# Altium schematic sheet COMPASS 3 AXIS.SchDoc
size A4
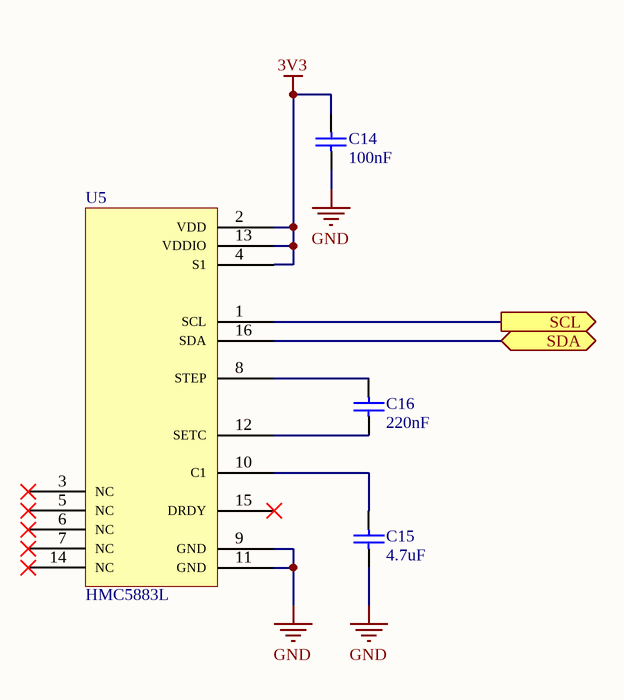
[diagram p0: COMPASS 3 AXIS.SchDoc]

## Parts
C14  100nF  [C0603(1608)]
C15  4.7uF  [C0603(1608)]
C16  220nF  [C0603(1608)]
U5  HMC5883L  [LGA 16 - 3x3]

## Ports
SCL (out), SDA (bidir)

## Nets
3V3: C14.2 U5.2(VDD) U5.4(S1) U5.13(VDDIO)
GND: C14.1 C15.1 U5.9(GND) U5.11(GND)
SCL: U5.1(SCL) ; port SCL
SDA: U5.16(SDA) ; port SDA
NetC15_2: C15.2 U5.10(C1)
NetC16_1: C16.1 U5.8(STEP)
NetC16_2: C16.2 U5.12(SETC)

Not connected (* = marked no-connect by the designer): U5 3(NC)* 5(NC)* 6(NC)* 7(NC)* 14(NC)* 15(DRDY)*

## Library data of the parts
C14-C16 = Cap: Capacitor
U5 = HMC5883L: IC COMPASS 3 AXIS I2C 16LCC SMD